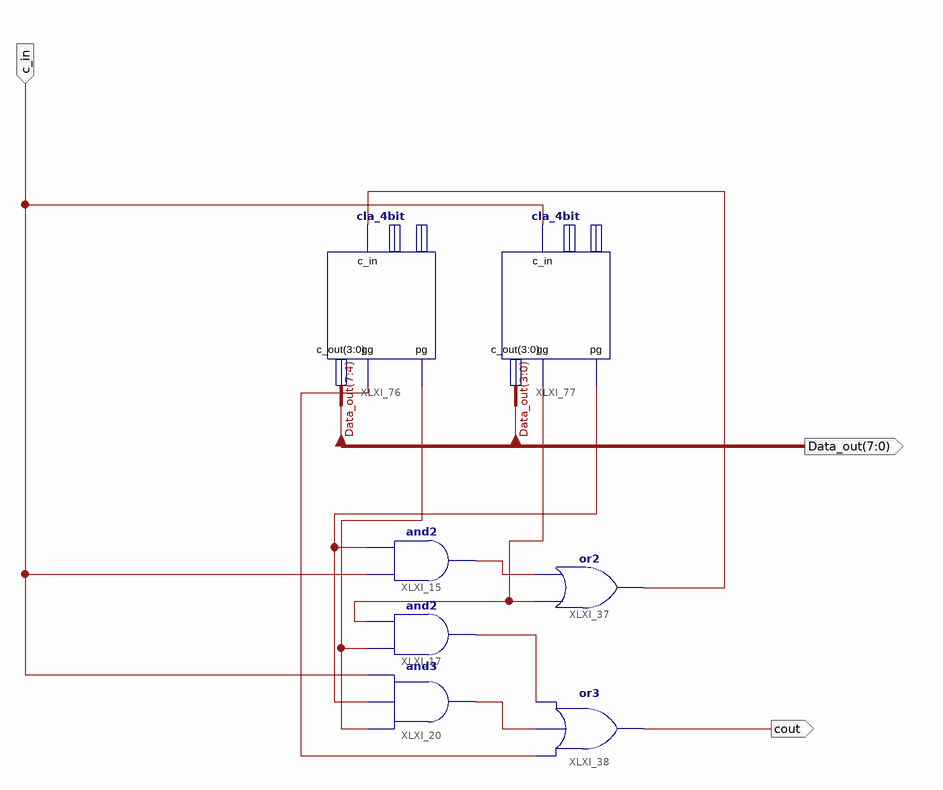
[diagram p0: schematic sheet 1]
// Xilinx ISE schematic alu_8bit.sch (spartan3e) as structural Verilog: 7 symbols, 3 ports
module alu_8bit (
  input  c_in,
  output [7:0] Data_out,
  output cout
);

  wire XLXN_28, XLXN_29, XLXN_34, XLXN_143, XLXN_146, XLXN_147, XLXN_148, XLXN_149;

  or XLXI_38 (cout, XLXN_147, XLXN_34, XLXN_29);
  or XLXI_37 (XLXN_143, XLXN_148, XLXN_28);
  and XLXI_15 (XLXN_28, c_in, XLXN_146);
  and XLXI_20 (XLXN_34, XLXN_149, XLXN_146, c_in);
  and XLXI_17 (XLXN_29, XLXN_149, XLXN_148);
  cla_4bit XLXI_76 (.c_in(XLXN_143), .pg(XLXN_149), .gg(XLXN_147), .c_out(Data_out[7:4]));  // open: p, g
  cla_4bit XLXI_77 (.c_in(c_in), .pg(XLXN_146), .gg(XLXN_148), .c_out(Data_out[3:0]));  // open: p, g
endmodule
